# Altium schematic sheet Node_Hub.SchDoc
size A; SheetNumber: 1; SheetTotal: 1
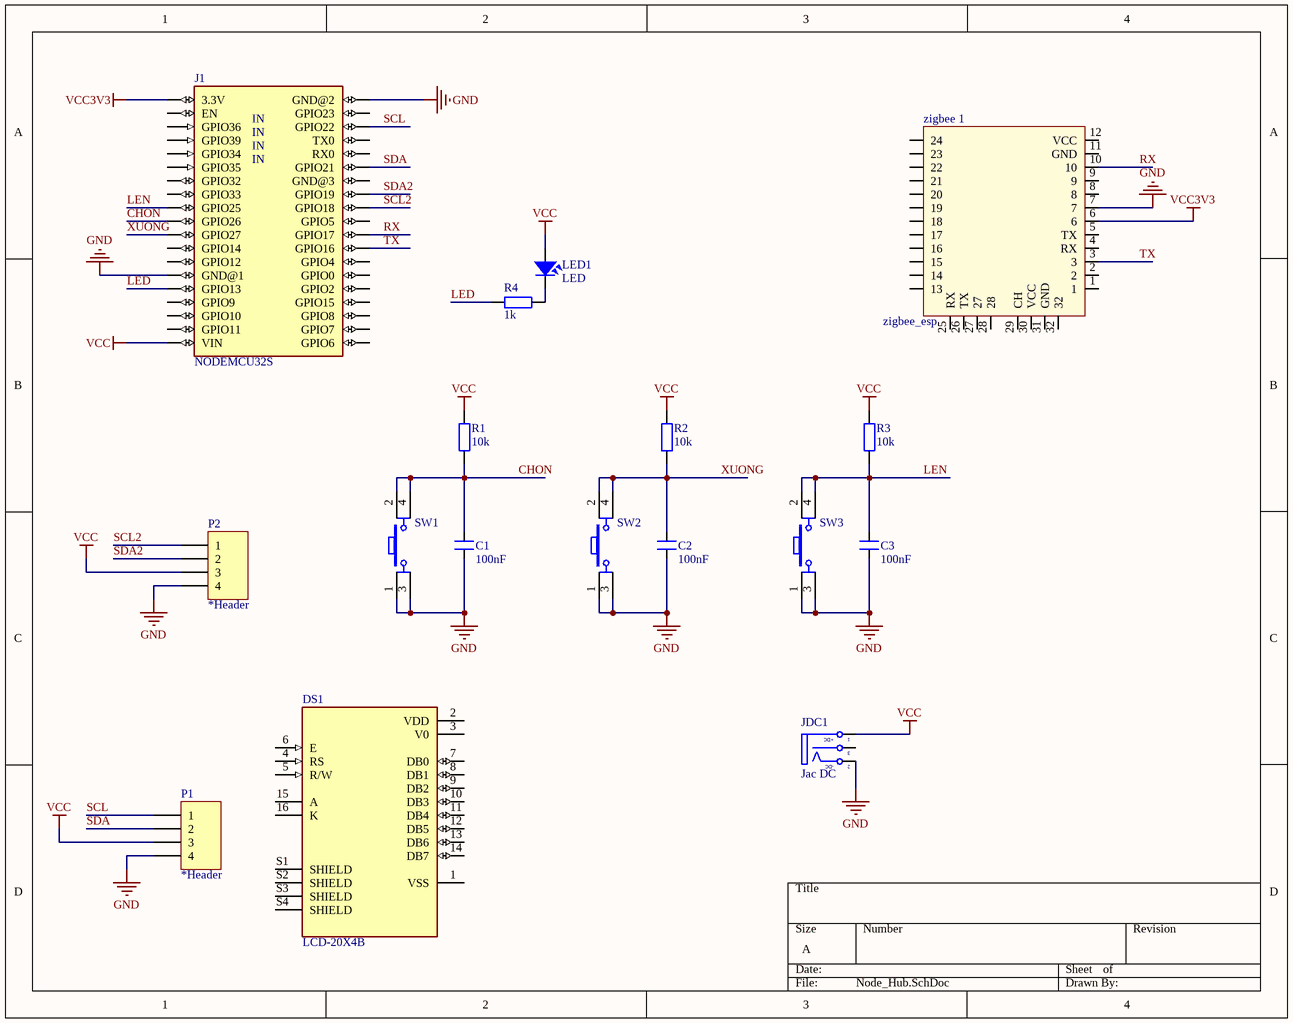
[diagram p0: Node_Hub.SchDoc]

## Parts
C1  100nF  [CN1]
C2  100nF  [CN1]
C3  100nF  [CN1]
DS1  LCD-20X4B  [LCD_LCD-20X4B]
J1  NODEMCU32S  [NODEMCU32S]
JDC1  Jac DC  [DC-IN]
LED1  LED  [LED-3]
P1  *Header  [HDR1X4]
P2  *Header  [HDR1X4]
R1  10k  [R1/4W]
R2  10k  [R1/4W]
R3  10k  [R1/4W]
R4  1k  [R1/4W]
SW1  SW  [SW4]  (value not drawn)
SW2  SW  [SW4]  (value not drawn)
SW3  SW  [SW4]  (value not drawn)
zigbee_1  zigbee_esp  [zigbee]

## Nets
GND: C1.1 C2.1 C3.1 J1.GND@1 J1.GND@2 JDC1.2(TN) P1.4 P2.4 SW1.1 SW1.3 SW2.1 SW2.3 SW3.1 SW3.3 zigbee_1.7
VCC: J1.VIN JDC1.1(T) LED1.1 P1.3 P2.3 R1.2 R2.2 R3.2
VCC3V3: J1.3V3(3.3V) zigbee_1.6
CHON: C1.2 J1.GPIO26 R1.1 SW1.2 SW1.4
LED: J1.GPIO13 R4.1
LEN: C3.2 J1.GPIO25 R3.1 SW3.2 SW3.4
RX: J1.GPIO17 zigbee_1.10
SCL: J1.GPIO22 P1.1
SCL2: J1.GPIO18 P2.1
SDA: J1.GPIO21 P1.2
SDA2: J1.GPIO19 P2.2
TX: J1.GPIO16 zigbee_1.3
XUONG: C2.2 J1.GPIO27 R2.1 SW2.2 SW2.4
NetLED1_2: LED1.2 R4.2

Not connected (* = marked no-connect by the designer): DS1 1(VSS) 2(VDD) 3(V0) 4(RS) 5(R/W) 6(E) 7(DB0) 8(DB1) 9(DB2) 10(DB3) 11(DB4) 12(DB5) 13(DB6) 14(DB7) 15(A) 16(K) S1(SHIELD) S2(SHIELD) S3(SHIELD) S4(SHIELD); J1 EN GND@3 GPIO0 GPIO2 GPIO4 GPIO5 GPIO6 GPIO7 GPIO8 GPIO9 GPIO10 GPIO11 GPIO12 GPIO14 GPIO15 GPIO23 GPIO32 GPIO33 GPIO34 GPIO35 GPIO36 GPIO39 RX0 TX0; JDC1 3(S); zigbee_1 1 2 4(RX) 5(TX) 8 9 11(GND) 12(VCC) 13 14 15 16 17 18 19 20 21 22 23 24 25(RX) 26(TX) 27 28 29(CH) 30(VCC) 31(GND) 32

## Notes on the sheet
- (in symbol DCIN) +DC; -DC
- (in symbol NODEMCU32S) IN

## Library data of the parts
C1-C3 = CN0: Cremic For Xtal 1pF => 100pF; Value: 33pF
DS1 = LCD-20X4B: Display Development Tools 20X4 CHARACTER BLUE LCD W/BACKLIGHT; MF: Gravitech; MP: LCD-20X4B; Purchase-URL: https://pricing.snapeda.com/search/part/LCD-20X4B/?ref=eda; Value: *; SnapEDA_Link: https://www.snapeda.com/parts/LCD-20X4B/Gravitech/view-part/?ref=snap; Price: None; Package: None; Check_prices: https://www.snapeda.com/parts/LCD-20X4B/Gravitech/view-part/?ref=eda; Availability: In Stock
J1 = NODEMCU32S: WIFI MODULE V1; MF: AI-Thinker; MP: NODEMCU-32S; Check_prices: https://www.snapeda.com/parts/NODEMCU-32S/AI-Thinker/view-part/?ref=eda; Package: Package; Price: None; Value: *; Availability: Not in stock; SnapEDA_Link: https://www.snapeda.com/parts/NODEMCU-32S/AI-Thinker/view-part/?ref=snap
JDC1 = DCIN: Jac DC input; Value: Jac DC
LED1 = LED: LED Single colour Green and Red; Value: LED 3 ly Single Colour
P1 P2 = Header 4: Header, 4-Pin, Right Angle; LatestRevisionDate: 17-Jul-2002; LatestRevisionNote: Re-released for DXP Platform.; Publisher: Altium Limited
R1-R4 = R1/4W: Resistor 1/4W; Value: R1/4W - 1K
SW1-SW3 = SW4: Switch button 4 pin; Value: Button chip 4 pin